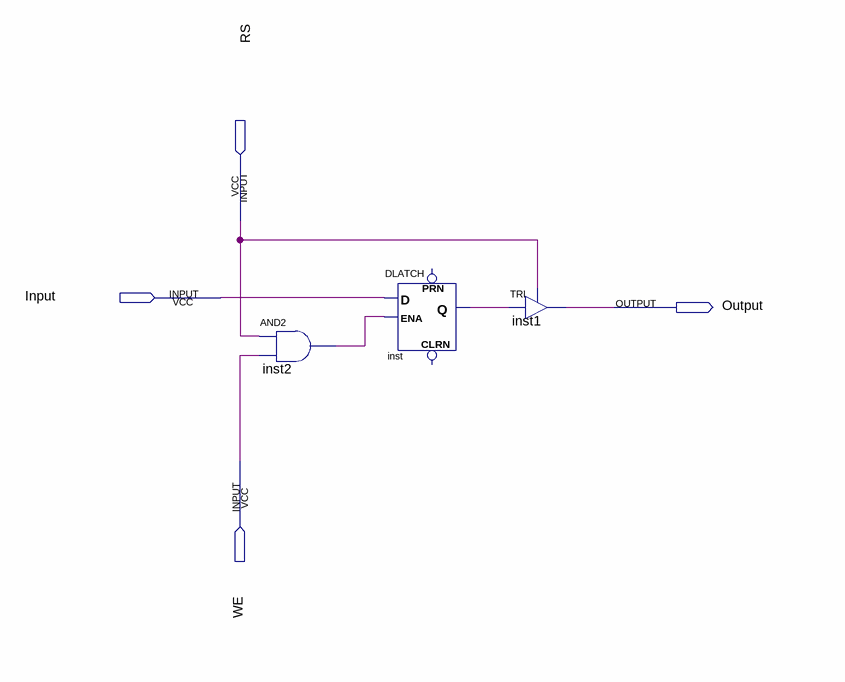
[diagram p0: schematic sheet]
// Quartus schematic memory_chip.bdf as structural Verilog: 3 symbols, 4 pins
module memory_chip (
  input  RS,
  input  Input,
  input  WE,
  output Output
);

  wire inst2_out, inst_q;

  and inst2 (inst2_out, RS, WE);
  DLATCH inst (.D(Input), .ENA(inst2_out), .Q(inst_q));  // open: CLRN, PRN
  TRI inst1 (.IN(inst_q), .OE(RS), .OUT(Output));
endmodule
